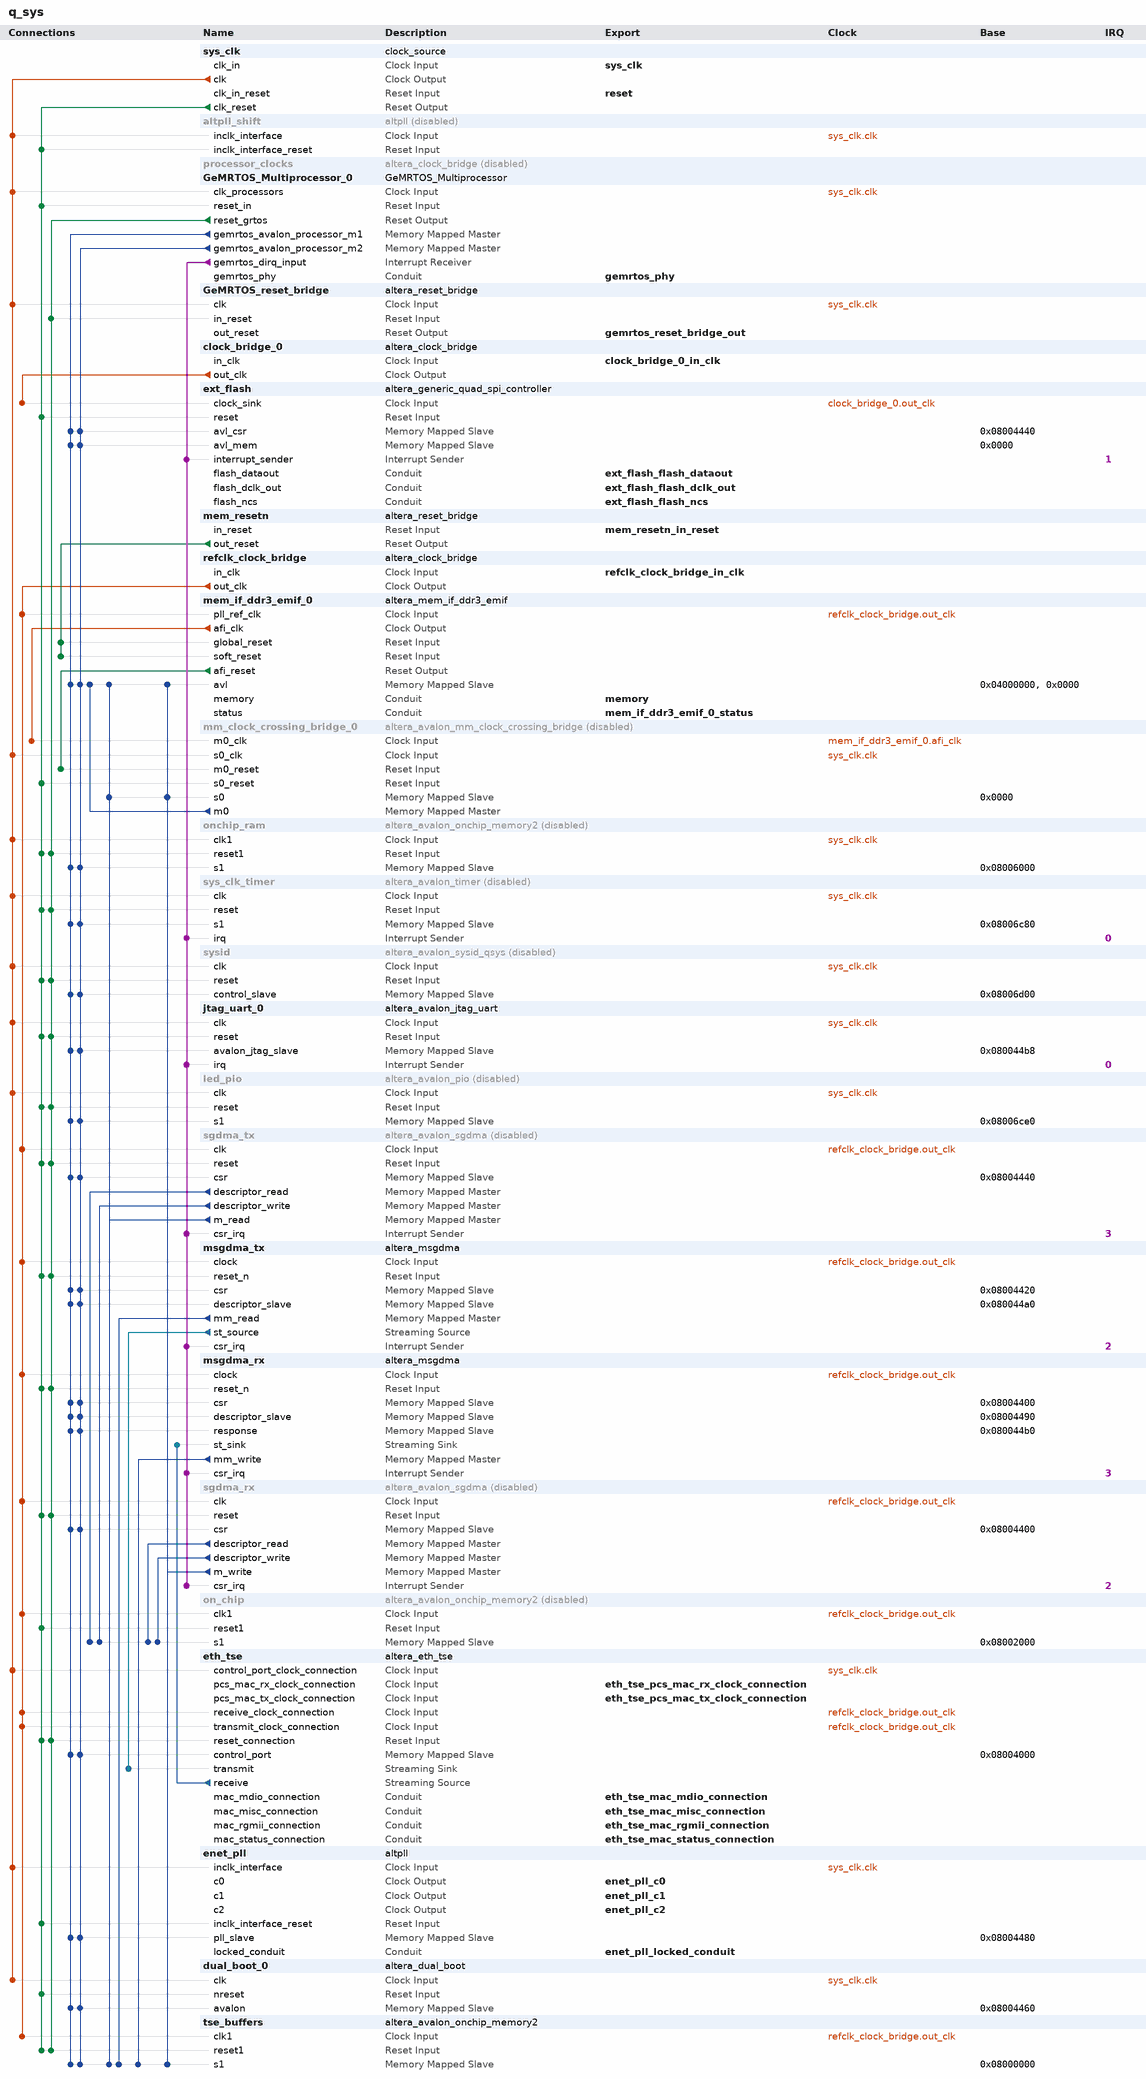
[diagram p0: system contents]
# Platform Designer (Qsys) system q_sys, MAX 10 10M50DAF484C6GES
# Parameters at their usual value, and those the tool derives, are not listed.
package require -exact qsys 23.1
create_system q_sys
set_project_property DEVICE_FAMILY {MAX 10}
set_project_property DEVICE 10M50DAF484C6GES

add_instance sys_clk clock_source 23.1
set_instance_parameter_value sys_clk clockFrequency 50000000
set_instance_parameter_value sys_clk resetSynchronousEdges DEASSERT

add_instance altpll_shift altpll 23.1
set_instance_property altpll_shift ENABLED false
set_instance_parameter_value altpll_shift CLK0_DIVIDE_BY 1
set_instance_parameter_value altpll_shift CLK0_MULTIPLY_BY 5
set_instance_parameter_value altpll_shift CLK1_DIVIDE_BY 2
set_instance_parameter_value altpll_shift CLK1_DUTY_CYCLE 50
set_instance_parameter_value altpll_shift CLK1_MULTIPLY_BY 1
set_instance_parameter_value altpll_shift CLK1_PHASE_SHIFT 0
set_instance_parameter_value altpll_shift CLK2_DIVIDE_BY 20
set_instance_parameter_value altpll_shift CLK2_DUTY_CYCLE 50
set_instance_parameter_value altpll_shift CLK2_MULTIPLY_BY 1
set_instance_parameter_value altpll_shift CLK2_PHASE_SHIFT 0
set_instance_parameter_value altpll_shift CLK3_DIVIDE_BY 2
set_instance_parameter_value altpll_shift CLK3_DUTY_CYCLE 50
set_instance_parameter_value altpll_shift CLK3_MULTIPLY_BY 5
set_instance_parameter_value altpll_shift CLK3_PHASE_SHIFT -3000
set_instance_parameter_value altpll_shift CLK4_DIVIDE_BY 2
set_instance_parameter_value altpll_shift CLK4_DUTY_CYCLE 50
set_instance_parameter_value altpll_shift CLK4_MULTIPLY_BY 1
set_instance_parameter_value altpll_shift CLK4_PHASE_SHIFT -10000
set_instance_parameter_value altpll_shift INCLK0_INPUT_FREQUENCY 20000
set_instance_parameter_value altpll_shift PORT_ARESET PORT_UNUSED
set_instance_parameter_value altpll_shift PORT_LOCKED PORT_USED
set_instance_parameter_value altpll_shift PORT_clk1 PORT_UNUSED
set_instance_parameter_value altpll_shift PORT_clk2 PORT_UNUSED
set_instance_parameter_value altpll_shift PORT_clk3 PORT_UNUSED

add_instance processor_clocks altera_clock_bridge 23.1
set_instance_property processor_clocks ENABLED false
set_instance_parameter_value processor_clocks DERIVED_CLOCK_RATE 0
set_instance_parameter_value processor_clocks EXPLICIT_CLOCK_RATE 25000000

add_instance GeMRTOS_Multiprocessor_0 GeMRTOS_Multiprocessor 1.0
set_instance_parameter_value GeMRTOS_Multiprocessor_0 BUS_WIDTH 28
set_instance_parameter_value GeMRTOS_Multiprocessor_0 DEVICE_NAME 10M50DAF484C6GES
set_instance_parameter_value GeMRTOS_Multiprocessor_0 ENABLE_HPS_MAP_ACCESS false
set_instance_parameter_value GeMRTOS_Multiprocessor_0 GeMRTOS_Frequency 50000000
set_instance_parameter_value GeMRTOS_Multiprocessor_0 GeMRTOS_INTERRUPTS 15
set_instance_parameter_value GeMRTOS_Multiprocessor_0 INCLUDE_JTAG_UART_PROCESSOR false
set_instance_parameter_value GeMRTOS_Multiprocessor_0 INCLUDE_JTAG_UART_STDDIO true
set_instance_parameter_value GeMRTOS_Multiprocessor_0 INCLUDE_JTAG_UART_STDERR true
set_instance_parameter_value GeMRTOS_Multiprocessor_0 INDEPENDENT_EXTERNAL_PROCESSOR_BUSES true
set_instance_parameter_value GeMRTOS_Multiprocessor_0 NProcessors 2
set_instance_parameter_value GeMRTOS_Multiprocessor_0 Processor_type {Nios V/m}
set_instance_parameter_value GeMRTOS_Multiprocessor_0 exceptionOffset 288
set_instance_parameter_value GeMRTOS_Multiprocessor_0 exceptionSlave mem_if_ddr3_emif_0.avl
set_instance_parameter_value GeMRTOS_Multiprocessor_0 icache_size_parameter None
set_instance_parameter_value GeMRTOS_Multiprocessor_0 pipelineArch_parameter True
set_instance_parameter_value GeMRTOS_Multiprocessor_0 resetOffset 4390912
set_instance_parameter_value GeMRTOS_Multiprocessor_0 resetSlave ext_flash.avl_mem

add_instance GeMRTOS_reset_bridge altera_reset_bridge 23.1
set_instance_parameter_value GeMRTOS_reset_bridge ACTIVE_LOW_RESET 0
set_instance_parameter_value GeMRTOS_reset_bridge SYNCHRONOUS_EDGES both

add_instance clock_bridge_0 altera_clock_bridge 23.1
set_instance_parameter_value clock_bridge_0 DERIVED_CLOCK_RATE 0
set_instance_parameter_value clock_bridge_0 EXPLICIT_CLOCK_RATE 0

add_instance ext_flash altera_generic_quad_spi_controller 23.1
set_instance_parameter_value ext_flash CHIP_SELS 1
set_instance_parameter_value ext_flash FLASH_TYPE Micron512
set_instance_parameter_value ext_flash IO_MODE QUAD
set_instance_parameter_value ext_flash UNIQUE_ID {$${FILENAME}_ext_flash}
set_instance_parameter_value ext_flash clkFreq 0

add_instance mem_resetn altera_reset_bridge 23.1
set_instance_parameter_value mem_resetn ACTIVE_LOW_RESET 1
set_instance_parameter_value mem_resetn SYNCHRONOUS_EDGES none

add_instance refclk_clock_bridge altera_clock_bridge 23.1
set_instance_parameter_value refclk_clock_bridge DERIVED_CLOCK_RATE 0
set_instance_parameter_value refclk_clock_bridge EXPLICIT_CLOCK_RATE 100000000

add_instance mem_if_ddr3_emif_0 altera_mem_if_ddr3_emif 23.1
set_instance_parameter_value mem_if_ddr3_emif_0 AVL_MAX_SIZE 4
set_instance_parameter_value mem_if_ddr3_emif_0 CALIBRATION_MODE Skip
set_instance_parameter_value mem_if_ddr3_emif_0 CPORT_TYPE_PORT Bidirectional,Bidirectional,Bidirectional,Bidirectional,Bidirectional,Bidirectional
set_instance_parameter_value mem_if_ddr3_emif_0 EXPORT_AFI_HALF_CLK false
set_instance_parameter_value mem_if_ddr3_emif_0 HARD_EMIF false
set_instance_parameter_value mem_if_ddr3_emif_0 MEM_BANKADDR_WIDTH 3
set_instance_parameter_value mem_if_ddr3_emif_0 MEM_CLK_FREQ 300.0
set_instance_parameter_value mem_if_ddr3_emif_0 MEM_CLK_FREQ_MAX 800.0
set_instance_parameter_value mem_if_ddr3_emif_0 MEM_COL_ADDR_WIDTH 10
set_instance_parameter_value mem_if_ddr3_emif_0 MEM_DQ_WIDTH 8
set_instance_parameter_value mem_if_ddr3_emif_0 MEM_DRV_STR RZQ/6
set_instance_parameter_value mem_if_ddr3_emif_0 MEM_FORMAT DISCRETE
set_instance_parameter_value mem_if_ddr3_emif_0 MEM_ROW_ADDR_WIDTH 13
set_instance_parameter_value mem_if_ddr3_emif_0 MEM_RTT_WR {Dynamic ODT off}
set_instance_parameter_value mem_if_ddr3_emif_0 MEM_TCL 5
set_instance_parameter_value mem_if_ddr3_emif_0 MEM_TFAW_NS 30.0
set_instance_parameter_value mem_if_ddr3_emif_0 MEM_TRAS_NS 35.0
set_instance_parameter_value mem_if_ddr3_emif_0 MEM_TRCD_NS 13.75
set_instance_parameter_value mem_if_ddr3_emif_0 MEM_TRFC_NS 110.0
set_instance_parameter_value mem_if_ddr3_emif_0 MEM_TRP_NS 13.75
set_instance_parameter_value mem_if_ddr3_emif_0 MEM_TRRD_NS 6.0
set_instance_parameter_value mem_if_ddr3_emif_0 MEM_TRTP_NS 7.5
set_instance_parameter_value mem_if_ddr3_emif_0 MEM_TWTR 6
set_instance_parameter_value mem_if_ddr3_emif_0 MEM_VENDOR JEDEC
set_instance_parameter_value mem_if_ddr3_emif_0 MEM_VERBOSE false
set_instance_parameter_value mem_if_ddr3_emif_0 MEM_WTCL 5
set_instance_parameter_value mem_if_ddr3_emif_0 PLL_LOCATION Top_Bottom
set_instance_parameter_value mem_if_ddr3_emif_0 POWER_OF_TWO_BUS true
set_instance_parameter_value mem_if_ddr3_emif_0 PRIORITY_PORT 1,1,1,1,1,1
set_instance_parameter_value mem_if_ddr3_emif_0 RATE Half
set_instance_parameter_value mem_if_ddr3_emif_0 REF_CLK_FREQ 100.0
set_instance_parameter_value mem_if_ddr3_emif_0 SPEED_GRADE 6
set_instance_parameter_value mem_if_ddr3_emif_0 TIMING_BOARD_AC_SKEW 0.07801
set_instance_parameter_value mem_if_ddr3_emif_0 TIMING_BOARD_AC_TO_CK_SKEW -0.04709
set_instance_parameter_value mem_if_ddr3_emif_0 TIMING_BOARD_DQ_TO_DQS_SKEW -0.01152
set_instance_parameter_value mem_if_ddr3_emif_0 TIMING_BOARD_MAX_CK_DELAY 0.2443
set_instance_parameter_value mem_if_ddr3_emif_0 TIMING_BOARD_MAX_DQS_DELAY 0.21929
set_instance_parameter_value mem_if_ddr3_emif_0 TIMING_BOARD_SKEW_BETWEEN_DQS 0.04246
set_instance_parameter_value mem_if_ddr3_emif_0 TIMING_BOARD_SKEW_CKDQS_DIMM_MAX 0.04429
set_instance_parameter_value mem_if_ddr3_emif_0 TIMING_BOARD_SKEW_CKDQS_DIMM_MIN 0.02286
set_instance_parameter_value mem_if_ddr3_emif_0 TIMING_BOARD_SKEW_WITHIN_DQS 0.01806
set_instance_parameter_value mem_if_ddr3_emif_0 TIMING_TDH 45
set_instance_parameter_value mem_if_ddr3_emif_0 TIMING_TDQSCK 225
set_instance_parameter_value mem_if_ddr3_emif_0 TIMING_TDQSQ 100
set_instance_parameter_value mem_if_ddr3_emif_0 TIMING_TDQSS 0.27
set_instance_parameter_value mem_if_ddr3_emif_0 TIMING_TDS 10
set_instance_parameter_value mem_if_ddr3_emif_0 TIMING_TDSH 0.18
set_instance_parameter_value mem_if_ddr3_emif_0 TIMING_TDSS 0.18
set_instance_parameter_value mem_if_ddr3_emif_0 TIMING_TIH 120
set_instance_parameter_value mem_if_ddr3_emif_0 TIMING_TIS 170
set_instance_parameter_value mem_if_ddr3_emif_0 TIMING_TQSH 0.4
set_instance_parameter_value mem_if_ddr3_emif_0 USER_DEBUG_LEVEL 1

add_instance mm_clock_crossing_bridge_0 altera_avalon_mm_clock_crossing_bridge 23.1
set_instance_property mm_clock_crossing_bridge_0 ENABLED false
set_instance_parameter_value mm_clock_crossing_bridge_0 ADDRESS_WIDTH 27
set_instance_parameter_value mm_clock_crossing_bridge_0 COMMAND_FIFO_DEPTH 4
set_instance_parameter_value mm_clock_crossing_bridge_0 DATA_WIDTH 32
set_instance_parameter_value mm_clock_crossing_bridge_0 MASTER_SYNC_DEPTH 2
set_instance_parameter_value mm_clock_crossing_bridge_0 MAX_BURST_SIZE 1
set_instance_parameter_value mm_clock_crossing_bridge_0 RESPONSE_FIFO_DEPTH 4
set_instance_parameter_value mm_clock_crossing_bridge_0 SLAVE_SYNC_DEPTH 2
set_instance_parameter_value mm_clock_crossing_bridge_0 USE_AUTO_ADDRESS_WIDTH 0

add_instance onchip_ram altera_avalon_onchip_memory2 23.1
set_instance_property onchip_ram ENABLED false
set_instance_parameter_value onchip_ram dataWidth 32
set_instance_parameter_value onchip_ram dualPort false
set_instance_parameter_value onchip_ram initMemContent false
set_instance_parameter_value onchip_ram initializationFileName onchip_mem.hex
set_instance_parameter_value onchip_ram memorySize 2048

add_instance sys_clk_timer altera_avalon_timer 23.1
set_instance_property sys_clk_timer ENABLED false
set_instance_parameter_value sys_clk_timer period 10
set_instance_parameter_value sys_clk_timer periodUnits MSEC

add_instance sysid altera_avalon_sysid_qsys 23.1
set_instance_property sysid ENABLED false
set_instance_parameter_value sysid id -87110914

add_instance jtag_uart_0 altera_avalon_jtag_uart 23.1
set_instance_parameter_value jtag_uart_0 simInteractiveOptions INTERACTIVE_ASCII_OUTPUT

add_instance led_pio altera_avalon_pio 23.1
set_instance_property led_pio ENABLED false
set_instance_parameter_value led_pio direction Output
set_instance_parameter_value led_pio resetValue 15
set_instance_parameter_value led_pio width 4

add_instance sgdma_tx altera_avalon_sgdma 23.1
set_instance_property sgdma_tx ENABLED false
set_instance_parameter_value sgdma_tx enableBurstTransfers false
set_instance_parameter_value sgdma_tx enableUnalignedTransfers false
set_instance_parameter_value sgdma_tx readBlockDataWidth 32
set_instance_parameter_value sgdma_tx sinkErrorWidth 0
set_instance_parameter_value sgdma_tx sourceErrorWidth 1
set_instance_parameter_value sgdma_tx transferMode MEMORY_TO_STREAM
set_instance_parameter_value sgdma_tx writeBurstcountWidth 4

add_instance msgdma_tx altera_msgdma 23.1
set_instance_parameter_value msgdma_tx BURST_ENABLE 0
set_instance_parameter_value msgdma_tx DATA_FIFO_DEPTH 64
set_instance_parameter_value msgdma_tx DATA_WIDTH 32
set_instance_parameter_value msgdma_tx DESCRIPTOR_FIFO_DEPTH 128
set_instance_parameter_value msgdma_tx ENHANCED_FEATURES 0
set_instance_parameter_value msgdma_tx ERROR_ENABLE 1
set_instance_parameter_value msgdma_tx ERROR_WIDTH 1
set_instance_parameter_value msgdma_tx MAX_BURST_COUNT 2
set_instance_parameter_value msgdma_tx MAX_BYTE 2048
set_instance_parameter_value msgdma_tx MODE 1
set_instance_parameter_value msgdma_tx PACKET_ENABLE 1
set_instance_parameter_value msgdma_tx TRANSFER_TYPE {Aligned Accesses}

add_instance msgdma_rx altera_msgdma 23.1
set_instance_parameter_value msgdma_rx BURST_ENABLE 0
set_instance_parameter_value msgdma_rx DATA_FIFO_DEPTH 64
set_instance_parameter_value msgdma_rx DATA_WIDTH 32
set_instance_parameter_value msgdma_rx DESCRIPTOR_FIFO_DEPTH 128
set_instance_parameter_value msgdma_rx ENHANCED_FEATURES 0
set_instance_parameter_value msgdma_rx ERROR_ENABLE 1
set_instance_parameter_value msgdma_rx ERROR_WIDTH 1
set_instance_parameter_value msgdma_rx MAX_BURST_COUNT 2
set_instance_parameter_value msgdma_rx MAX_BYTE 2048
set_instance_parameter_value msgdma_rx MODE 2
set_instance_parameter_value msgdma_rx PACKET_ENABLE 1
set_instance_parameter_value msgdma_rx RESPONSE_PORT 0
set_instance_parameter_value msgdma_rx TRANSFER_TYPE {Aligned Accesses}

add_instance sgdma_rx altera_avalon_sgdma 23.1
set_instance_property sgdma_rx ENABLED false
set_instance_parameter_value sgdma_rx enableBurstTransfers false
set_instance_parameter_value sgdma_rx enableUnalignedTransfers false
set_instance_parameter_value sgdma_rx readBlockDataWidth 32
set_instance_parameter_value sgdma_rx sinkErrorWidth 6
set_instance_parameter_value sgdma_rx sourceErrorWidth 0
set_instance_parameter_value sgdma_rx transferMode STREAM_TO_MEMORY
set_instance_parameter_value sgdma_rx writeBurstcountWidth 4

add_instance on_chip altera_avalon_onchip_memory2 23.1
set_instance_property on_chip ENABLED false
set_instance_parameter_value on_chip dataWidth 32
set_instance_parameter_value on_chip dualPort false
set_instance_parameter_value on_chip initMemContent false
set_instance_parameter_value on_chip initializationFileName descriptor_memory
set_instance_parameter_value on_chip memorySize 8192

add_instance eth_tse altera_eth_tse 23.1
set_instance_parameter_value eth_tse XCVR_RCFG_JTAG_ENABLE 0
set_instance_parameter_value eth_tse XCVR_SET_CAPABILITY_REG_ENABLE 0
set_instance_parameter_value eth_tse XCVR_SET_CSR_SOFT_LOGIC_ENABLE 0
set_instance_parameter_value eth_tse XCVR_SET_PRBS_SOFT_LOGIC_ENABLE 0
set_instance_parameter_value eth_tse XCVR_SET_USER_IDENTIFIER 0
set_instance_parameter_value eth_tse core_variation MAC_ONLY
set_instance_parameter_value eth_tse enable_hd_logic true
set_instance_parameter_value eth_tse enable_mac_flow_ctrl false
set_instance_parameter_value eth_tse enable_magic_detect false
set_instance_parameter_value eth_tse enable_sgmii true
set_instance_parameter_value eth_tse enable_shift16 false
set_instance_parameter_value eth_tse ifGMII RGMII
set_instance_parameter_value eth_tse ing_addr 11
set_instance_parameter_value eth_tse mdio_clk_div 40
set_instance_parameter_value eth_tse nf_phyip_rcfg_enable true
set_instance_parameter_value eth_tse stat_cnt_ena false
set_instance_parameter_value eth_tse transceiver_type NONE

add_instance enet_pll altpll 23.1
set_instance_parameter_value enet_pll CLK0_DIVIDE_BY 2
set_instance_parameter_value enet_pll CLK0_MULTIPLY_BY 5
set_instance_parameter_value enet_pll CLK1_DIVIDE_BY 2
set_instance_parameter_value enet_pll CLK1_DUTY_CYCLE 50
set_instance_parameter_value enet_pll CLK1_MULTIPLY_BY 1
set_instance_parameter_value enet_pll CLK1_PHASE_SHIFT 0
set_instance_parameter_value enet_pll CLK2_DIVIDE_BY 20
set_instance_parameter_value enet_pll CLK2_DUTY_CYCLE 50
set_instance_parameter_value enet_pll CLK2_MULTIPLY_BY 1
set_instance_parameter_value enet_pll CLK2_PHASE_SHIFT 0
set_instance_parameter_value enet_pll CLK3_DIVIDE_BY 1
set_instance_parameter_value enet_pll CLK3_DUTY_CYCLE 50
set_instance_parameter_value enet_pll CLK3_MULTIPLY_BY 1
set_instance_parameter_value enet_pll CLK3_PHASE_SHIFT 5000
set_instance_parameter_value enet_pll CLK4_DIVIDE_BY 2
set_instance_parameter_value enet_pll CLK4_DUTY_CYCLE 50
set_instance_parameter_value enet_pll CLK4_MULTIPLY_BY 1
set_instance_parameter_value enet_pll CLK4_PHASE_SHIFT 20000
set_instance_parameter_value enet_pll INCLK0_INPUT_FREQUENCY 20000
set_instance_parameter_value enet_pll OPERATION_MODE NO_COMPENSATION
set_instance_parameter_value enet_pll PORT_ARESET PORT_UNUSED
set_instance_parameter_value enet_pll PORT_LOCKED PORT_USED
set_instance_parameter_value enet_pll PORT_clk1 PORT_USED
set_instance_parameter_value enet_pll PORT_clk2 PORT_USED
set_instance_parameter_value enet_pll PORT_clk3 PORT_UNUSED

add_instance dual_boot_0 altera_dual_boot 23.1
set_instance_parameter_value dual_boot_0 CLOCK_FREQUENCY 50.0

add_instance tse_buffers altera_avalon_onchip_memory2 23.1
set_instance_parameter_value tse_buffers dataWidth 32
set_instance_parameter_value tse_buffers dualPort false
set_instance_parameter_value tse_buffers initMemContent true
set_instance_parameter_value tse_buffers initializationFileName onchip_mem.hex
set_instance_parameter_value tse_buffers memorySize 4096

# connections
add_connection clock_bridge_0.out_clk ext_flash.clock_sink clock
add_connection mem_if_ddr3_emif_0.afi_clk mm_clock_crossing_bridge_0.m0_clk clock
add_connection refclk_clock_bridge.out_clk eth_tse.receive_clock_connection clock
add_connection refclk_clock_bridge.out_clk eth_tse.transmit_clock_connection clock
add_connection refclk_clock_bridge.out_clk mem_if_ddr3_emif_0.pll_ref_clk clock
add_connection refclk_clock_bridge.out_clk msgdma_rx.clock clock
add_connection refclk_clock_bridge.out_clk msgdma_tx.clock clock
add_connection refclk_clock_bridge.out_clk on_chip.clk1 clock
add_connection refclk_clock_bridge.out_clk sgdma_rx.clk clock
add_connection refclk_clock_bridge.out_clk sgdma_tx.clk clock
add_connection refclk_clock_bridge.out_clk tse_buffers.clk1 clock
add_connection sys_clk.clk altpll_shift.inclk_interface clock
add_connection sys_clk.clk dual_boot_0.clk clock
add_connection sys_clk.clk enet_pll.inclk_interface clock
add_connection sys_clk.clk eth_tse.control_port_clock_connection clock
add_connection sys_clk.clk GeMRTOS_Multiprocessor_0.clk_processors clock
add_connection sys_clk.clk GeMRTOS_reset_bridge.clk clock
add_connection sys_clk.clk jtag_uart_0.clk clock
add_connection sys_clk.clk led_pio.clk clock
add_connection sys_clk.clk mm_clock_crossing_bridge_0.s0_clk clock
add_connection sys_clk.clk onchip_ram.clk1 clock
add_connection sys_clk.clk sys_clk_timer.clk clock
add_connection sys_clk.clk sysid.clk clock
add_connection GeMRTOS_Multiprocessor_0.reset_grtos eth_tse.reset_connection reset
add_connection GeMRTOS_Multiprocessor_0.reset_grtos GeMRTOS_reset_bridge.in_reset reset
add_connection GeMRTOS_Multiprocessor_0.reset_grtos jtag_uart_0.reset reset
add_connection GeMRTOS_Multiprocessor_0.reset_grtos led_pio.reset reset
add_connection GeMRTOS_Multiprocessor_0.reset_grtos msgdma_rx.reset_n reset
add_connection GeMRTOS_Multiprocessor_0.reset_grtos msgdma_tx.reset_n reset
add_connection GeMRTOS_Multiprocessor_0.reset_grtos onchip_ram.reset1 reset
add_connection GeMRTOS_Multiprocessor_0.reset_grtos sgdma_rx.reset reset
add_connection GeMRTOS_Multiprocessor_0.reset_grtos sgdma_tx.reset reset
add_connection GeMRTOS_Multiprocessor_0.reset_grtos sys_clk_timer.reset reset
add_connection GeMRTOS_Multiprocessor_0.reset_grtos sysid.reset reset
add_connection GeMRTOS_Multiprocessor_0.reset_grtos tse_buffers.reset1 reset
add_connection mem_if_ddr3_emif_0.afi_reset mm_clock_crossing_bridge_0.m0_reset reset
add_connection mem_resetn.out_reset mem_if_ddr3_emif_0.global_reset reset
add_connection mem_resetn.out_reset mem_if_ddr3_emif_0.soft_reset reset
add_connection sys_clk.clk_reset altpll_shift.inclk_interface_reset reset
add_connection sys_clk.clk_reset dual_boot_0.nreset reset
add_connection sys_clk.clk_reset enet_pll.inclk_interface_reset reset
add_connection sys_clk.clk_reset eth_tse.reset_connection reset
add_connection sys_clk.clk_reset ext_flash.reset reset
add_connection sys_clk.clk_reset GeMRTOS_Multiprocessor_0.reset_in reset
add_connection sys_clk.clk_reset jtag_uart_0.reset reset
add_connection sys_clk.clk_reset led_pio.reset reset
add_connection sys_clk.clk_reset mm_clock_crossing_bridge_0.s0_reset reset
add_connection sys_clk.clk_reset msgdma_rx.reset_n reset
add_connection sys_clk.clk_reset msgdma_tx.reset_n reset
add_connection sys_clk.clk_reset on_chip.reset1 reset
add_connection sys_clk.clk_reset onchip_ram.reset1 reset
add_connection sys_clk.clk_reset sgdma_rx.reset reset
add_connection sys_clk.clk_reset sgdma_tx.reset reset
add_connection sys_clk.clk_reset sys_clk_timer.reset reset
add_connection sys_clk.clk_reset sysid.reset reset
add_connection sys_clk.clk_reset tse_buffers.reset1 reset
add_connection GeMRTOS_Multiprocessor_0.gemrtos_avalon_processor_m1 dual_boot_0.avalon avalon
set_connection_parameter_value GeMRTOS_Multiprocessor_0.gemrtos_avalon_processor_m1/dual_boot_0.avalon baseAddress 0x08004460
add_connection GeMRTOS_Multiprocessor_0.gemrtos_avalon_processor_m1 enet_pll.pll_slave avalon
set_connection_parameter_value GeMRTOS_Multiprocessor_0.gemrtos_avalon_processor_m1/enet_pll.pll_slave baseAddress 0x08004480
add_connection GeMRTOS_Multiprocessor_0.gemrtos_avalon_processor_m1 eth_tse.control_port avalon
set_connection_parameter_value GeMRTOS_Multiprocessor_0.gemrtos_avalon_processor_m1/eth_tse.control_port baseAddress 0x08004000
add_connection GeMRTOS_Multiprocessor_0.gemrtos_avalon_processor_m1 ext_flash.avl_csr avalon
set_connection_parameter_value GeMRTOS_Multiprocessor_0.gemrtos_avalon_processor_m1/ext_flash.avl_csr baseAddress 0x08004440
add_connection GeMRTOS_Multiprocessor_0.gemrtos_avalon_processor_m1 ext_flash.avl_mem avalon
set_connection_parameter_value GeMRTOS_Multiprocessor_0.gemrtos_avalon_processor_m1/ext_flash.avl_mem baseAddress 0x0000
add_connection GeMRTOS_Multiprocessor_0.gemrtos_avalon_processor_m1 jtag_uart_0.avalon_jtag_slave avalon
set_connection_parameter_value GeMRTOS_Multiprocessor_0.gemrtos_avalon_processor_m1/jtag_uart_0.avalon_jtag_slave baseAddress 0x080044b8
add_connection GeMRTOS_Multiprocessor_0.gemrtos_avalon_processor_m1 led_pio.s1 avalon
set_connection_parameter_value GeMRTOS_Multiprocessor_0.gemrtos_avalon_processor_m1/led_pio.s1 baseAddress 0x08006ce0
add_connection GeMRTOS_Multiprocessor_0.gemrtos_avalon_processor_m1 mem_if_ddr3_emif_0.avl avalon
set_connection_parameter_value GeMRTOS_Multiprocessor_0.gemrtos_avalon_processor_m1/mem_if_ddr3_emif_0.avl baseAddress 0x04000000
add_connection GeMRTOS_Multiprocessor_0.gemrtos_avalon_processor_m1 msgdma_rx.csr avalon
set_connection_parameter_value GeMRTOS_Multiprocessor_0.gemrtos_avalon_processor_m1/msgdma_rx.csr baseAddress 0x08004400
add_connection GeMRTOS_Multiprocessor_0.gemrtos_avalon_processor_m1 msgdma_rx.descriptor_slave avalon
set_connection_parameter_value GeMRTOS_Multiprocessor_0.gemrtos_avalon_processor_m1/msgdma_rx.descriptor_slave baseAddress 0x08004490
add_connection GeMRTOS_Multiprocessor_0.gemrtos_avalon_processor_m1 msgdma_rx.response avalon
set_connection_parameter_value GeMRTOS_Multiprocessor_0.gemrtos_avalon_processor_m1/msgdma_rx.response baseAddress 0x080044b0
add_connection GeMRTOS_Multiprocessor_0.gemrtos_avalon_processor_m1 msgdma_tx.csr avalon
set_connection_parameter_value GeMRTOS_Multiprocessor_0.gemrtos_avalon_processor_m1/msgdma_tx.csr baseAddress 0x08004420
add_connection GeMRTOS_Multiprocessor_0.gemrtos_avalon_processor_m1 msgdma_tx.descriptor_slave avalon
set_connection_parameter_value GeMRTOS_Multiprocessor_0.gemrtos_avalon_processor_m1/msgdma_tx.descriptor_slave baseAddress 0x080044a0
add_connection GeMRTOS_Multiprocessor_0.gemrtos_avalon_processor_m1 onchip_ram.s1 avalon
set_connection_parameter_value GeMRTOS_Multiprocessor_0.gemrtos_avalon_processor_m1/onchip_ram.s1 baseAddress 0x08006000
add_connection GeMRTOS_Multiprocessor_0.gemrtos_avalon_processor_m1 sgdma_rx.csr avalon
set_connection_parameter_value GeMRTOS_Multiprocessor_0.gemrtos_avalon_processor_m1/sgdma_rx.csr baseAddress 0x08004400
add_connection GeMRTOS_Multiprocessor_0.gemrtos_avalon_processor_m1 sgdma_tx.csr avalon
set_connection_parameter_value GeMRTOS_Multiprocessor_0.gemrtos_avalon_processor_m1/sgdma_tx.csr baseAddress 0x08004440
add_connection GeMRTOS_Multiprocessor_0.gemrtos_avalon_processor_m1 sys_clk_timer.s1 avalon
set_connection_parameter_value GeMRTOS_Multiprocessor_0.gemrtos_avalon_processor_m1/sys_clk_timer.s1 baseAddress 0x08006c80
add_connection GeMRTOS_Multiprocessor_0.gemrtos_avalon_processor_m1 sysid.control_slave avalon
set_connection_parameter_value GeMRTOS_Multiprocessor_0.gemrtos_avalon_processor_m1/sysid.control_slave baseAddress 0x08006d00
add_connection GeMRTOS_Multiprocessor_0.gemrtos_avalon_processor_m1 tse_buffers.s1 avalon
set_connection_parameter_value GeMRTOS_Multiprocessor_0.gemrtos_avalon_processor_m1/tse_buffers.s1 baseAddress 0x08000000
add_connection GeMRTOS_Multiprocessor_0.gemrtos_avalon_processor_m2 dual_boot_0.avalon avalon
set_connection_parameter_value GeMRTOS_Multiprocessor_0.gemrtos_avalon_processor_m2/dual_boot_0.avalon baseAddress 0x08004460
add_connection GeMRTOS_Multiprocessor_0.gemrtos_avalon_processor_m2 enet_pll.pll_slave avalon
set_connection_parameter_value GeMRTOS_Multiprocessor_0.gemrtos_avalon_processor_m2/enet_pll.pll_slave baseAddress 0x08004480
add_connection GeMRTOS_Multiprocessor_0.gemrtos_avalon_processor_m2 eth_tse.control_port avalon
set_connection_parameter_value GeMRTOS_Multiprocessor_0.gemrtos_avalon_processor_m2/eth_tse.control_port baseAddress 0x08004000
add_connection GeMRTOS_Multiprocessor_0.gemrtos_avalon_processor_m2 ext_flash.avl_csr avalon
set_connection_parameter_value GeMRTOS_Multiprocessor_0.gemrtos_avalon_processor_m2/ext_flash.avl_csr baseAddress 0x08004440
add_connection GeMRTOS_Multiprocessor_0.gemrtos_avalon_processor_m2 ext_flash.avl_mem avalon
set_connection_parameter_value GeMRTOS_Multiprocessor_0.gemrtos_avalon_processor_m2/ext_flash.avl_mem baseAddress 0x0000
add_connection GeMRTOS_Multiprocessor_0.gemrtos_avalon_processor_m2 jtag_uart_0.avalon_jtag_slave avalon
set_connection_parameter_value GeMRTOS_Multiprocessor_0.gemrtos_avalon_processor_m2/jtag_uart_0.avalon_jtag_slave baseAddress 0x080044b8
add_connection GeMRTOS_Multiprocessor_0.gemrtos_avalon_processor_m2 led_pio.s1 avalon
set_connection_parameter_value GeMRTOS_Multiprocessor_0.gemrtos_avalon_processor_m2/led_pio.s1 baseAddress 0x08006ce0
add_connection GeMRTOS_Multiprocessor_0.gemrtos_avalon_processor_m2 mem_if_ddr3_emif_0.avl avalon
set_connection_parameter_value GeMRTOS_Multiprocessor_0.gemrtos_avalon_processor_m2/mem_if_ddr3_emif_0.avl baseAddress 0x04000000
add_connection GeMRTOS_Multiprocessor_0.gemrtos_avalon_processor_m2 msgdma_rx.csr avalon
set_connection_parameter_value GeMRTOS_Multiprocessor_0.gemrtos_avalon_processor_m2/msgdma_rx.csr baseAddress 0x08004400
add_connection GeMRTOS_Multiprocessor_0.gemrtos_avalon_processor_m2 msgdma_rx.descriptor_slave avalon
set_connection_parameter_value GeMRTOS_Multiprocessor_0.gemrtos_avalon_processor_m2/msgdma_rx.descriptor_slave baseAddress 0x08004490
add_connection GeMRTOS_Multiprocessor_0.gemrtos_avalon_processor_m2 msgdma_rx.response avalon
set_connection_parameter_value GeMRTOS_Multiprocessor_0.gemrtos_avalon_processor_m2/msgdma_rx.response baseAddress 0x080044b0
add_connection GeMRTOS_Multiprocessor_0.gemrtos_avalon_processor_m2 msgdma_tx.csr avalon
set_connection_parameter_value GeMRTOS_Multiprocessor_0.gemrtos_avalon_processor_m2/msgdma_tx.csr baseAddress 0x08004420
add_connection GeMRTOS_Multiprocessor_0.gemrtos_avalon_processor_m2 msgdma_tx.descriptor_slave avalon
set_connection_parameter_value GeMRTOS_Multiprocessor_0.gemrtos_avalon_processor_m2/msgdma_tx.descriptor_slave baseAddress 0x080044a0
add_connection GeMRTOS_Multiprocessor_0.gemrtos_avalon_processor_m2 onchip_ram.s1 avalon
set_connection_parameter_value GeMRTOS_Multiprocessor_0.gemrtos_avalon_processor_m2/onchip_ram.s1 baseAddress 0x08006000
add_connection GeMRTOS_Multiprocessor_0.gemrtos_avalon_processor_m2 sgdma_rx.csr avalon
set_connection_parameter_value GeMRTOS_Multiprocessor_0.gemrtos_avalon_processor_m2/sgdma_rx.csr baseAddress 0x08004400
add_connection GeMRTOS_Multiprocessor_0.gemrtos_avalon_processor_m2 sgdma_tx.csr avalon
set_connection_parameter_value GeMRTOS_Multiprocessor_0.gemrtos_avalon_processor_m2/sgdma_tx.csr baseAddress 0x08004440
add_connection GeMRTOS_Multiprocessor_0.gemrtos_avalon_processor_m2 sys_clk_timer.s1 avalon
set_connection_parameter_value GeMRTOS_Multiprocessor_0.gemrtos_avalon_processor_m2/sys_clk_timer.s1 baseAddress 0x08006c80
add_connection GeMRTOS_Multiprocessor_0.gemrtos_avalon_processor_m2 sysid.control_slave avalon
set_connection_parameter_value GeMRTOS_Multiprocessor_0.gemrtos_avalon_processor_m2/sysid.control_slave baseAddress 0x08006d00
add_connection GeMRTOS_Multiprocessor_0.gemrtos_avalon_processor_m2 tse_buffers.s1 avalon
set_connection_parameter_value GeMRTOS_Multiprocessor_0.gemrtos_avalon_processor_m2/tse_buffers.s1 baseAddress 0x08000000
add_connection mm_clock_crossing_bridge_0.m0 mem_if_ddr3_emif_0.avl avalon
set_connection_parameter_value mm_clock_crossing_bridge_0.m0/mem_if_ddr3_emif_0.avl baseAddress 0x0000
add_connection msgdma_rx.mm_write tse_buffers.s1 avalon
set_connection_parameter_value msgdma_rx.mm_write/tse_buffers.s1 baseAddress 0x08000000
add_connection msgdma_tx.mm_read tse_buffers.s1 avalon
set_connection_parameter_value msgdma_tx.mm_read/tse_buffers.s1 baseAddress 0x08000000
add_connection sgdma_rx.descriptor_read on_chip.s1 avalon
set_connection_parameter_value sgdma_rx.descriptor_read/on_chip.s1 baseAddress 0x08002000
add_connection sgdma_rx.descriptor_write on_chip.s1 avalon
set_connection_parameter_value sgdma_rx.descriptor_write/on_chip.s1 baseAddress 0x08002000
add_connection sgdma_rx.m_write mem_if_ddr3_emif_0.avl avalon
set_connection_parameter_value sgdma_rx.m_write/mem_if_ddr3_emif_0.avl baseAddress 0x04000000
add_connection sgdma_rx.m_write mm_clock_crossing_bridge_0.s0 avalon
set_connection_parameter_value sgdma_rx.m_write/mm_clock_crossing_bridge_0.s0 baseAddress 0x0000
add_connection sgdma_rx.m_write tse_buffers.s1 avalon
set_connection_parameter_value sgdma_rx.m_write/tse_buffers.s1 baseAddress 0x08000000
add_connection sgdma_tx.descriptor_read on_chip.s1 avalon
set_connection_parameter_value sgdma_tx.descriptor_read/on_chip.s1 baseAddress 0x08002000
add_connection sgdma_tx.descriptor_write on_chip.s1 avalon
set_connection_parameter_value sgdma_tx.descriptor_write/on_chip.s1 baseAddress 0x08002000
add_connection sgdma_tx.m_read mem_if_ddr3_emif_0.avl avalon
set_connection_parameter_value sgdma_tx.m_read/mem_if_ddr3_emif_0.avl baseAddress 0x04000000
add_connection sgdma_tx.m_read mm_clock_crossing_bridge_0.s0 avalon
set_connection_parameter_value sgdma_tx.m_read/mm_clock_crossing_bridge_0.s0 baseAddress 0x0000
add_connection sgdma_tx.m_read tse_buffers.s1 avalon
set_connection_parameter_value sgdma_tx.m_read/tse_buffers.s1 baseAddress 0x08000000
add_connection eth_tse.receive msgdma_rx.st_sink avalon_streaming
add_connection msgdma_tx.st_source eth_tse.transmit avalon_streaming
add_connection GeMRTOS_Multiprocessor_0.gemrtos_dirq_input ext_flash.interrupt_sender interrupt
set_connection_parameter_value GeMRTOS_Multiprocessor_0.gemrtos_dirq_input/ext_flash.interrupt_sender irqNumber 1
add_connection GeMRTOS_Multiprocessor_0.gemrtos_dirq_input jtag_uart_0.irq interrupt
set_connection_parameter_value GeMRTOS_Multiprocessor_0.gemrtos_dirq_input/jtag_uart_0.irq irqNumber 0
add_connection GeMRTOS_Multiprocessor_0.gemrtos_dirq_input msgdma_rx.csr_irq interrupt
set_connection_parameter_value GeMRTOS_Multiprocessor_0.gemrtos_dirq_input/msgdma_rx.csr_irq irqNumber 3
add_connection GeMRTOS_Multiprocessor_0.gemrtos_dirq_input msgdma_tx.csr_irq interrupt
set_connection_parameter_value GeMRTOS_Multiprocessor_0.gemrtos_dirq_input/msgdma_tx.csr_irq irqNumber 2
add_connection GeMRTOS_Multiprocessor_0.gemrtos_dirq_input sgdma_rx.csr_irq interrupt
set_connection_parameter_value GeMRTOS_Multiprocessor_0.gemrtos_dirq_input/sgdma_rx.csr_irq irqNumber 2
add_connection GeMRTOS_Multiprocessor_0.gemrtos_dirq_input sgdma_tx.csr_irq interrupt
set_connection_parameter_value GeMRTOS_Multiprocessor_0.gemrtos_dirq_input/sgdma_tx.csr_irq irqNumber 3
add_connection GeMRTOS_Multiprocessor_0.gemrtos_dirq_input sys_clk_timer.irq interrupt
set_connection_parameter_value GeMRTOS_Multiprocessor_0.gemrtos_dirq_input/sys_clk_timer.irq irqNumber 0

# exported interfaces
add_interface clock_bridge_0_in_clk clock sink
set_interface_property clock_bridge_0_in_clk EXPORT_OF clock_bridge_0.in_clk
add_interface enet_pll_c0 clock source
set_interface_property enet_pll_c0 EXPORT_OF enet_pll.c0
add_interface enet_pll_c1 clock source
set_interface_property enet_pll_c1 EXPORT_OF enet_pll.c1
add_interface enet_pll_c2 clock source
set_interface_property enet_pll_c2 EXPORT_OF enet_pll.c2
add_interface enet_pll_locked_conduit conduit end
set_interface_property enet_pll_locked_conduit EXPORT_OF enet_pll.locked_conduit
add_interface eth_tse_mac_mdio_connection conduit end
set_interface_property eth_tse_mac_mdio_connection EXPORT_OF eth_tse.mac_mdio_connection
add_interface eth_tse_mac_misc_connection conduit end
set_interface_property eth_tse_mac_misc_connection EXPORT_OF eth_tse.mac_misc_connection
add_interface eth_tse_mac_rgmii_connection conduit end
set_interface_property eth_tse_mac_rgmii_connection EXPORT_OF eth_tse.mac_rgmii_connection
add_interface eth_tse_mac_status_connection conduit end
set_interface_property eth_tse_mac_status_connection EXPORT_OF eth_tse.mac_status_connection
add_interface eth_tse_pcs_mac_rx_clock_connection clock sink
set_interface_property eth_tse_pcs_mac_rx_clock_connection EXPORT_OF eth_tse.pcs_mac_rx_clock_connection
add_interface eth_tse_pcs_mac_tx_clock_connection clock sink
set_interface_property eth_tse_pcs_mac_tx_clock_connection EXPORT_OF eth_tse.pcs_mac_tx_clock_connection
add_interface ext_flash_flash_dataout conduit end
set_interface_property ext_flash_flash_dataout EXPORT_OF ext_flash.flash_dataout
add_interface ext_flash_flash_dclk_out conduit end
set_interface_property ext_flash_flash_dclk_out EXPORT_OF ext_flash.flash_dclk_out
add_interface ext_flash_flash_ncs conduit end
set_interface_property ext_flash_flash_ncs EXPORT_OF ext_flash.flash_ncs
add_interface gemrtos_phy conduit end
set_interface_property gemrtos_phy EXPORT_OF GeMRTOS_Multiprocessor_0.gemrtos_phy
add_interface gemrtos_reset_bridge_out reset source
set_interface_property gemrtos_reset_bridge_out EXPORT_OF GeMRTOS_reset_bridge.out_reset
add_interface mem_if_ddr3_emif_0_status conduit end
set_interface_property mem_if_ddr3_emif_0_status EXPORT_OF mem_if_ddr3_emif_0.status
add_interface mem_resetn_in_reset reset sink
set_interface_property mem_resetn_in_reset EXPORT_OF mem_resetn.in_reset
add_interface memory conduit end
set_interface_property memory EXPORT_OF mem_if_ddr3_emif_0.memory
add_interface refclk_clock_bridge_in_clk clock sink
set_interface_property refclk_clock_bridge_in_clk EXPORT_OF refclk_clock_bridge.in_clk
add_interface reset reset sink
set_interface_property reset EXPORT_OF sys_clk.clk_in_reset
add_interface sys_clk clock sink
set_interface_property sys_clk EXPORT_OF sys_clk.clk_in

set_interconnect_requirement {$system} qsys_mm.clockCrossingAdapter HANDSHAKE
set_interconnect_requirement {$system} qsys_mm.maxAdditionalLatency 0

save_system q_sys.qsys
